# EAGLE design sound-detector (EAGLE 7.7.0)
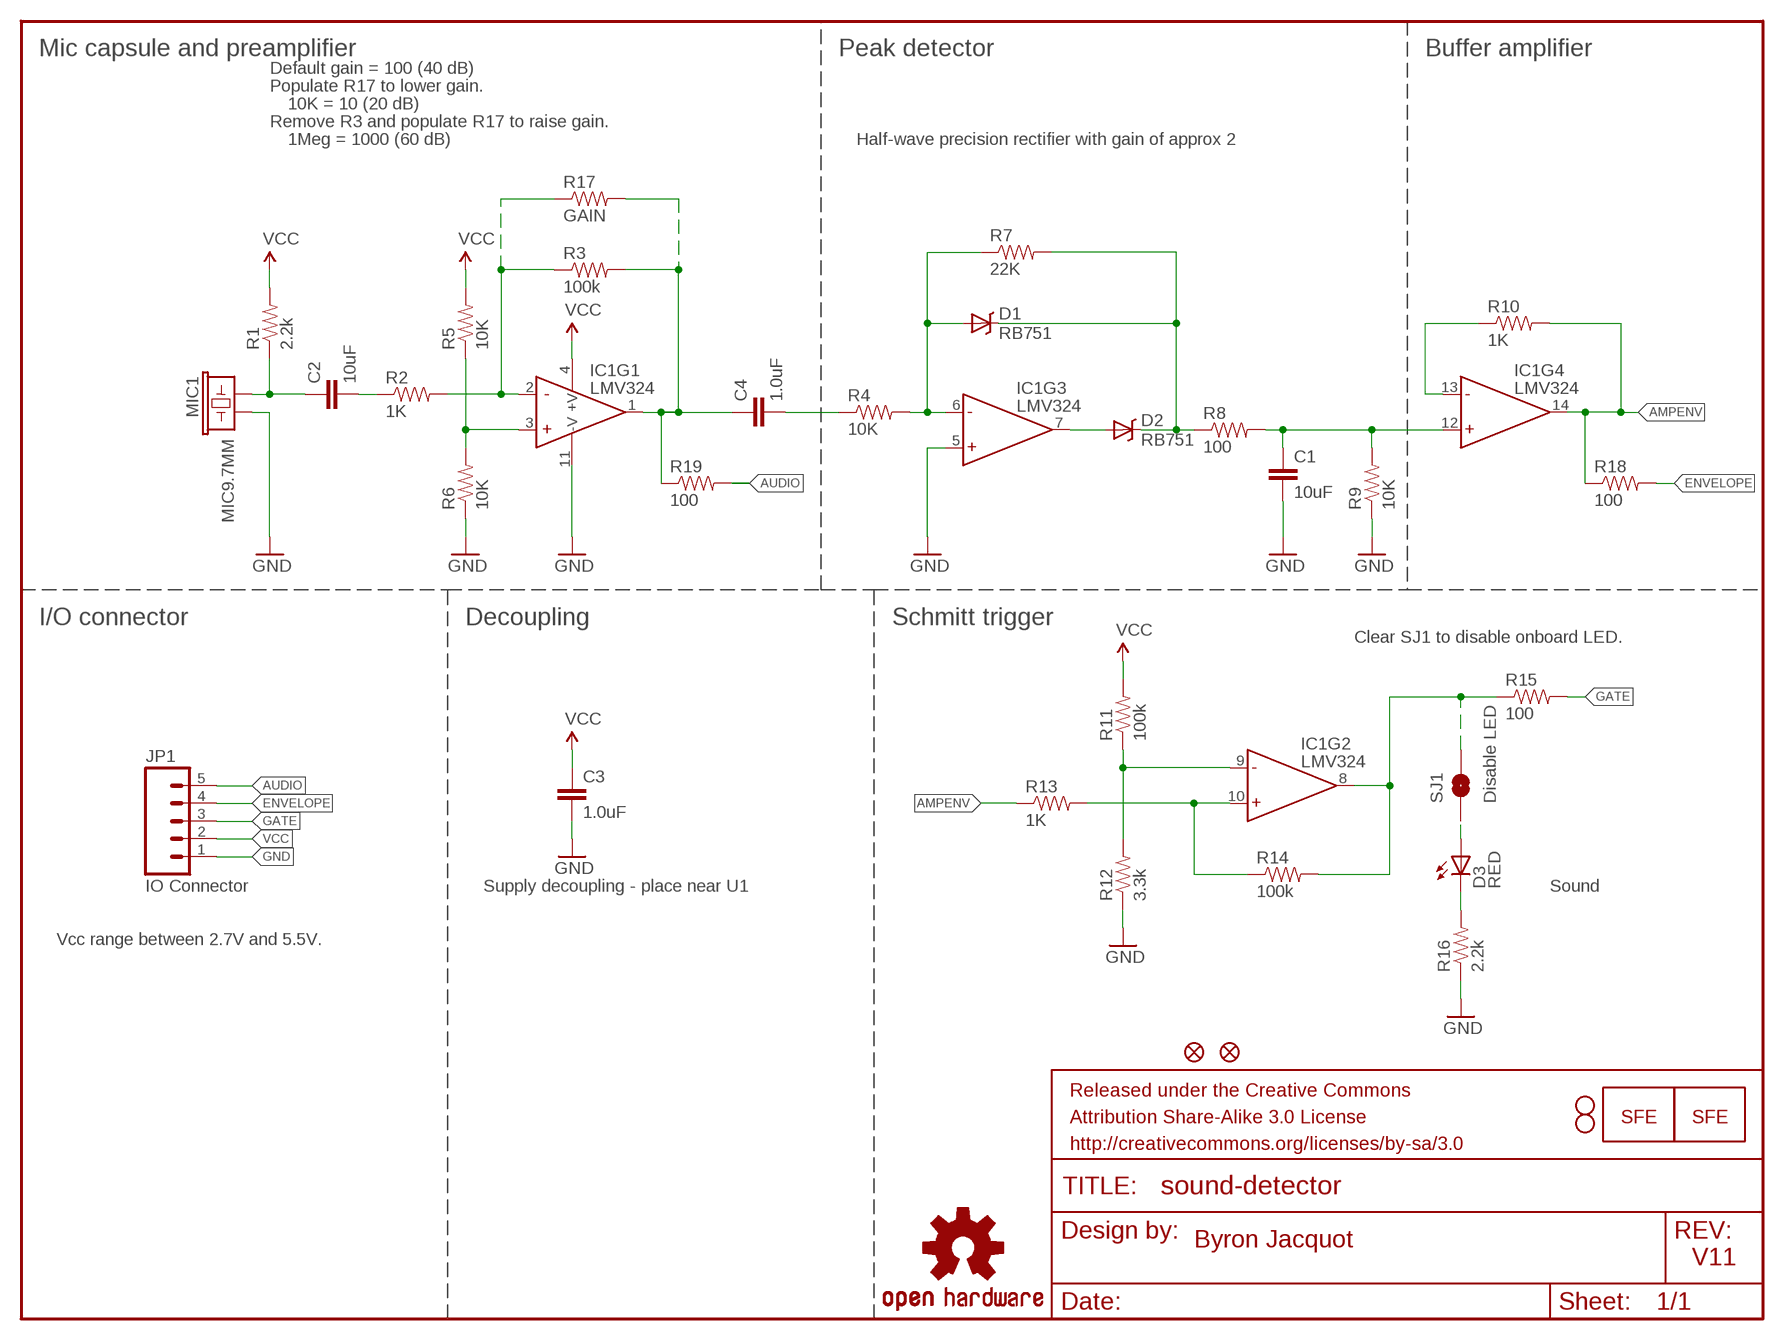
[diagram p0: schematic, sheet 1]

## Parts
C1  10uF  10UF-6.3V-20%(1206)  [1206]
C2  10uF  10UF-6.3V-20%(1206)  [1206]
C3  1.0uF  1.0UF-16V-10%(0603)  [0603-CAP]
C4  1.0uF  1.0UF-16V-10%(0603)  [0603-CAP]
D1  RB751  [SOD-523]
D2  RB751  [SOD-523]
D3  RED  LED-RED0603  [LED-0603]
FID3  FIDUCIAL1X2  [FIDUCIAL-1X2]
FID4  FIDUCIAL1X2  [FIDUCIAL-1X2]
FRAME1  FRAME-LETTER  [CREATIVE_COMMONS]
IC1  LMV324  [SO014]
JP1  IO Connector  M05PTH  [1X05]
LOGO1  OSHW-LOGOM  [OSHW-LOGO-M]
LOGO2  LOGO-SFENW2  [SFE-NEW-WEB]
LOGO3  LOGO-SFESK  [SFE-LOGO-FLAME]
MIC1  MIC9.7MM  [MIC-9.7MM]
R1  2.2k  2.2KOHM1/10W1%(0603)  [0603-RES]
R2  1K  1KOHM1/10W1%(0603)  [0603-RES]
R3  100k  100KOHM1/10W1%(0603)  [0603-RES]
R4  10K  10KOHM1/10W1%(0603)0603  [0603-RES]
R5  10K  10KOHM1/10W1%(0603)0603  [0603-RES]
R6  10K  10KOHM1/10W1%(0603)0603  [0603-RES]
R7  22K  22KOHM1/10W1%(0603)  [0603-RES]
R8  100  100OHM1/10W1%(0603)  [0603-RES]
R9  10K  10KOHM1/10W1%(0603)0603  [0603-RES]
R10  1K  1KOHM1/10W1%(0603)  [0603-RES]
R11  100k  100KOHM1/10W1%(0603)  [0603-RES]
R12  3.3k  3.3KOHM1/10W1%(0603)  [0603-RES]
R13  1K  1KOHM1/10W1%(0603)  [0603-RES]
R14  100k  100KOHM1/10W1%(0603)  [0603-RES]
R15  100  100OHM1/10W1%(0603)  [0603-RES]
R16  2.2k  2.2KOHM1/10W1%(0603)  [0603-RES]
R17  GAIN  RESISTORPTH-1/4W-VERT-KIT  [AXIAL-0.1EZ]
R18  100  100OHM1/10W1%(0603)  [0603-RES]
R19  100  100OHM1/10W1%(0603)  [0603-RES]
SJ1  Disable LED  SOLDERJUMPERNC  [SJ_2S]
STANDOFF1  STAND-OFF  [STAND-OFF]
STANDOFF2  STAND-OFF  [STAND-OFF]

## Nets
AMPENV: IC1.14(OUT) R10.2 R13.1 R18.1
AUDIO: JP1.5 R19.2
ENVELOPE: JP1.4 R18.2
GATE: JP1.3 R15.2
GND: C1.2 C3.2 IC1.5(+IN) IC1.11(-V) JP1.1 MIC1.2 R6.1 R9.1 R12.1 R16.1
N$: C4.1 IC1.1(OUT) R3.2 R17.P$2 R19.1
N$1: C2.1 MIC1.1 R1.1
N$2: IC1.3(+IN) R5.1 R6.2
N$3: D3.C R16.2
N$4: IC1.2(-IN) R2.2 R3.1 R17.P$1
N$5: C2.2 R2.1
N$6: C4.2 R4.1
N$7: D1.A IC1.6(-IN) R4.2 R7.1
N$8: D2.A IC1.7(OUT)
N$9: D1.C D2.C R7.2 R8.1
N$10: C1.1 IC1.12(+IN) R8.2 R9.2
N$11: IC1.13(-IN) R10.1
N$12: D3.A SJ1.1
N$15: IC1.9(-IN) R11.1 R12.2
N$16: IC1.10(+IN) R13.2 R14.1
N$17: IC1.8(OUT) R14.2 R15.1 SJ1.2
VCC: C3.1 IC1.4(+V) JP1.2 R1.2 R5.2 R11.2

## Notes on the sheet
- Mic capsule and preamplifier | Peak detector | Buffer amplifier
- Default gain = 100 (40 dB)
- Populate R17 to lower gain.
- 10K = 10 (20 dB)
- Remove R3 and populate R17 to raise gain.
- 1Meg = 1000 (60 dB) | Half-wave precision rectifier with gain of approx 2
- I/O connector | Decoupling | Schmitt trigger
- Clear SJ1 to disable onboard LED.
- Supply decoupling - place near U1 | Sound
- Vcc range between 2.7V and 5.5V.
- Byron Jacquot
- V11

## Library data of the parts
C1 C2 = SparkFun-Capacitors:10UF-6.3V-20%(1206): Ceramic CAP-10057; PROD_ID: CAP-10057
C3 C4 = SparkFun-Capacitors:1.0UF-16V-10%(0603): CAP-00868; PROD_ID: CAP-00868
D1 D2 = SparkFun-DiscreteSemi:RB751: 40V 120mA SOD-523 Schottky DIO-11018; PROD_ID: DIO-11018
D3 = SparkFun-LED:LED-RED: Assorted Red LEDs LilyPad 1206- DIO-09912 1206- DIO-00809 0603- DIO-00819; PROD_ID: DIO-00819
FID3 FID4 = SparkFun-Aesthetics:FIDUCIAL: Fiducial Alignment Points Various fiducial points for machine vision alignment.
FRAME1 = SparkFun-Aesthetics:FRAME-LETTER: Schematic Frame Standard 8.5x11 US Letter frame
IC1 = SparkFun-AnalogIC:LMV324: Jellybean quad op-amp; PROD_ID: IC-08227
JP1 = SparkFun-Connectors:M05: Header 5 Standard 5-pin 0.1" header. Use with straight break away headers (SKU : PRT-00116), right angle break away headers (PRT-00553), swiss pins (PRT-00743), machine pins (PRT-00117), and female headers (PRT-00115). Molex polarized connector foot print use with SKU : PRT-08230 with associated crimp pins and housings.
LOGO1 = SparkFun-Aesthetics:OSHW-LOGO: Open Source Hardware Logo This logo indicates the piece of hardware it is found on incorporates a OSHW license and/or adheres to the definition of open source hardware found here: http://freedomdefined.org/OSHW
LOGO2 LOGO3 = SparkFun-Aesthetics:LOGO-SFE: Spark Fun Electronics PCB Logo This is the standard Spark Fun Electronics PCB logo.
MIC1 = SparkFun-Sensors:MIC: Omni-directional electret microphone. 9.7mm standard diameter.; PROD_ID: COMP-08856
R1 R16 = SparkFun-Resistors:2.2KOHM1/10W1%(0603): RES-08272; PROD_ID: RES-08272
R2 R10 R13 = SparkFun-Resistors:1KOHM1/10W1%(0603): RES-07856; PROD_ID: RES-07856
R3 R11 R14 = SparkFun-Resistors:100KOHM1/10W1%(0603): RES-07828; PROD_ID: RES-07828
R4-R6 R9 = SparkFun-Resistors:10KOHM1/10W1%(0603): RES-00824; PROD_ID: RES-00824
R7 = SparkFun-Resistors:22KOHM1/10W1%(0603): RES-07853; PROD_ID: RES-07853
R8 R15 R18 R19 = SparkFun-Resistors:100OHM1/10W1%(0603): RES-07863; PROD_ID: RES-07863
R12 = SparkFun-Resistors:3.3KOHM1/10W1%(0603): RES-07851; PROD_ID: RES-07851
R17 = SparkFun-Resistors:RESISTOR: Resistor Basic schematic elements and footprints for 0603, 1206, and PTH resistors.
SJ1 = SparkFun-Passives:SOLDERJUMPER: Solder Jumper Standard SMD solder jumper. Used to automate production. Two varients : Normally Open and Normally Closed are the same, but have different paste layers. NC will have a large amount of paste and should jumper during reflow.
STANDOFF1 STANDOFF2 = SparkFun-Electromechanical:STAND-OFF: #4 Stand Off This is the mechanical footprint for a #4 phillips button head screw. Use the keepout ring to avoid running the screw head into surrounding components. SKU : PRT-00447

## Board
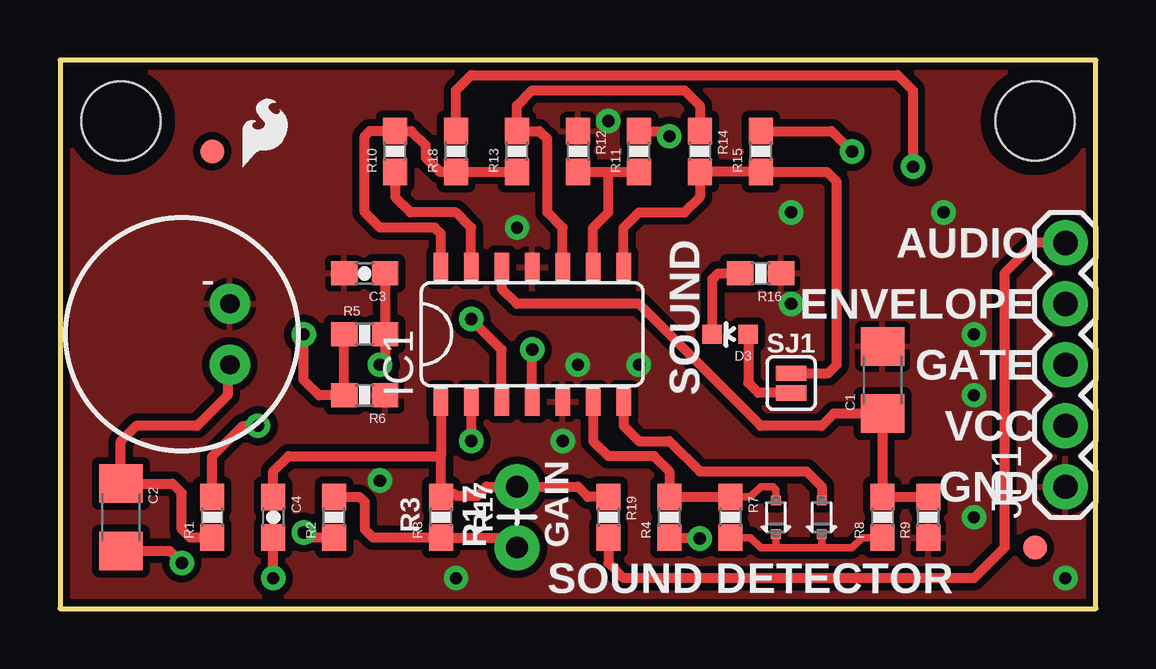
[diagram p1: board, top side]
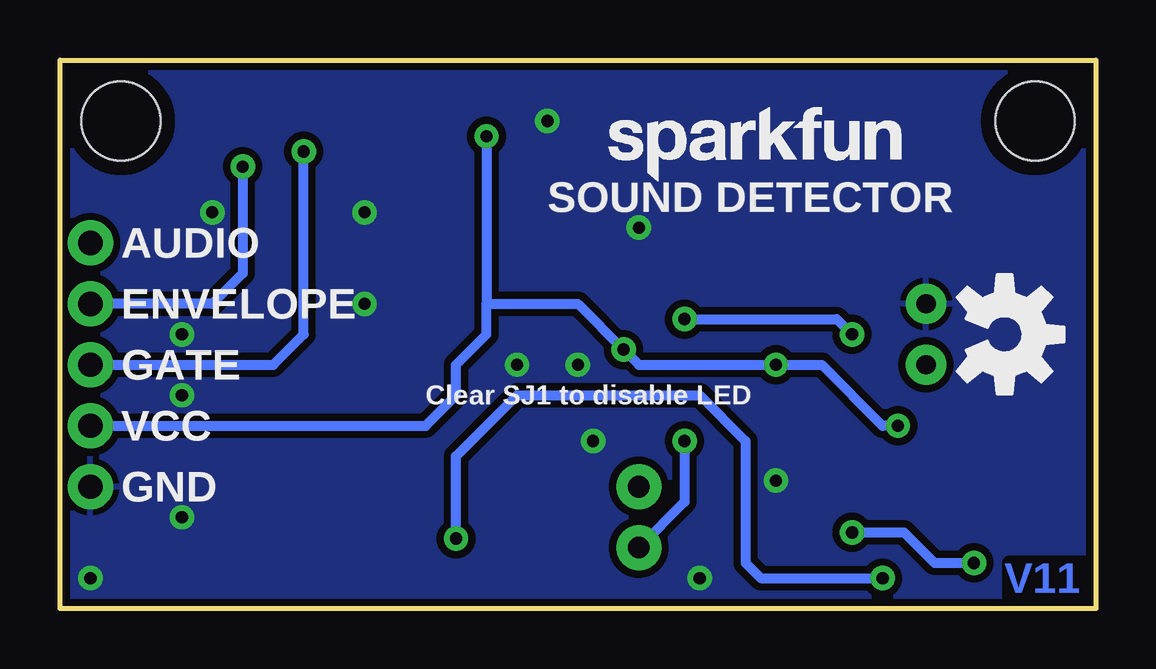
[diagram p2: board, bottom side, seen from below]

Size 43.18 x 22.86 mm. Coordinates in mm from the lower left corner, seen from the top.
Outline: 0,0 43.18,0 43.18,22.86 0,22.86 0,0
Copper layers (1*16): Top 0.035mm / dielectric 1.5mm / Bottom 0.035mm
Design rules "SparkFun-2-layer *": minimum track width 7mil, minimum drill 15mil, track to track 8mil, track to pad 8mil, pad to pad 8mil, via to via 8mil, smd to smd 8mil, copper to edge 8mil, drill to drill 8mil, minimum pad ring 12mil, minimum via ring 10mil, stop-mask expansion 4mil, vias tented up to drill 20mil, thermal gap 10mil

### Footprints (pad centres in the part's own frame; a part is rotated, then mirrored left to right if it is on the bottom)
1206 = smd 1.6 x 1.8: 1 -1.4,0; 2 1.4,0
0603-CAP = smd 1.1 x 1: 1 -0.85,0; 2 0.85,0
SOD-523 = smd 0.4 x 0.4: A -0.7,0; C 0.7,0
LED-0603 = smd 0.8 x 0.8: A 0,-0.75; C 0,0.75
FIDUCIAL-1X2 = smd 1 x 1: 1 0,0
SO014 = smd 0.6 x 1.2: 1 -3.175,-2.8; 2 -1.905,-2.8; 3 -0.635,-2.8; 4 0.635,-2.8; 5 1.905,-2.8; 6 3.175,-2.8; 7 4.445,-2.8; 8 4.445,2.8; 9 3.175,2.8; 10 1.905,2.8; 11 0.635,2.8; 12 -0.635,2.8; 13 -1.905,2.8; 14 -3.175,2.8
1X05 = drill 1.016 pad 1.88: 1 0,0; 2 2.54,0; 3 5.08,0; 4 7.62,0; 5 10.16,0
MIC-9.7MM = drill 0.8 pad 1.676: 1 -2,1.27; 2 -2,-1.27
0603-RES = smd 1.1 x 1: 1 -0.85,0; 2 0.85,0
AXIAL-0.1EZ = drill 0.9 pad 1.88: P$1 0,0; P$2 2.54,0
SJ_2S = smd 0.635 x 1.27: 1 -0.412,0; 2 0.412,0
STAND-OFF = hole 3.302: 0,0

### Placement (x,y rotation side)
C1  34.29,9.53 90 top
C2  2.54,3.81 270 top
C3  12.7,13.97 180 top
C4  8.89,3.81 270 top
D1  29.84,3.81 270 top
D2  31.75,3.81 270 top
D3  27.94,11.43 90 top
FID3  40.64,2.54 0 top
FID4  6.35,19.05 0 top
FRAME1  1.27,-10.16 0 top  (outside the outline)
IC1  19.05,11.43 0 top
JP1  41.91,5.08 90 top
LOGO1  3.81,11.43 270 bottom
LOGO2  20.32,17.78 0 bottom
LOGO3  7.62,18.41 0 top
MIC1  5.08,11.43 180 top
R1  6.35,3.81 90 top
R2  11.43,3.81 90 top
R3  15.88,3.81 90 top
R4  25.4,3.81 90 top
R5  12.7,11.43 0 top
R6  12.7,8.89 180 top
R7  27.94,3.81 270 top
R8  34.29,3.81 90 top
R9  36.2,3.81 90 top
R10  13.97,19.05 90 top
R11  24.13,19.05 90 top
R12  21.59,19.05 270 top
R13  19.05,19.05 90 top
R14  26.67,19.05 270 top
R15  29.21,19.05 90 top
R16  29.21,13.97 180 top
R17  19.05,2.54 90 top
R18  16.51,19.05 90 top
R19  22.86,3.81 270 top
SJ1  30.48,9.4 90 top
STANDOFF1  2.54,20.32 0 top
STANDOFF2  40.64,20.32 0 top

### Tracks (layer width: path | path; a pad name or v marks a point on that pad's centre or on a via)
AMPENV
  Top 0.406: R13.1 R18.1 15.84,18.2 15.24,18.8 15.24,19.3 14.64,19.9 R10.2 12.91,19.9 12.7,19.68 12.7,16.51 13.34,15.88 15.62,15.88 15.88,15.62 IC1.14
AUDIO
  Top 0.406: JP1.5 40.64,15.24 39.37,13.97 39.37,2.54 38.1,1.27 23.5,1.27 22.86,1.91 R19.2
ENVELOPE  (via drill 0.51)
  Top 0.406: R18.2 16.51,21.59 17.14,22.23 34.92,22.23 35.56,21.59 v35.56,18.41
  Bottom 0.406: v35.56,18.41 35.56,13.97 36.83,12.7 JP1.4
GATE  (via drill 0.51)
  Top 0.406: R15.2 32.17,19.9 v33.02,19.05
  Bottom 0.406: JP1.3 34.29,10.16 33.02,11.43 v33.02,19.05
GND  (via drill 0.51)
  other vias: 22.86,20.32 19.05,15.88 38.1,3.81 38.1,8.89 36.83,16.51 38.1,11.43 24.13,10.16 21.59,10.16 41.91,1.27 16.51,1.27 30.48,16.51 30.48,12.7 13.34,5.33 20.95,6.99
  pour Bottom (isolate 0.305): 0,0 0,22.86 43.18,22.86 43.18,0
  pour Top (isolate 0.305): 0,0 0,22.86 43.18,22.86 43.18,0
N$
  Top 0.406: IC1.1 15.88,6.35 | 15.88,6.35 R3.2 arc-90 16.55,4.7 17.4,4.7 17.78,5.08 R17.P$2 21.59,5.08 22.01,4.66 R19.1 | C4.1 8.89,5.71 9.53,6.35 15.88,6.35
N$1
  Top 0.406: MIC1.1 6.99,10.06 6.99,8.89 5.71,7.62 3.17,7.62 2.54,6.99 C2.1 4.7,5.21 5.08,4.83 5.08,3.3 5.42,2.96 R1.1
N$2  (via drill 0.51)
  Top 0.406: R5.1 R6.2 10.79,8.89 10.16,9.53 v10.16,11.43 | IC1.3 18.41,10.79 v17.14,12.06
  Bottom 0.406: v17.14,12.06 10.79,12.06 v10.16,11.43
N$3
  Top 0.406: D3.C 27.19,13.73 27.43,13.97 R16.2
N$4  (via drill 0.51)
  Top 0.406: R17.P$1 18.63,2.96 R3.1 13.04,2.96 12.7,3.3 12.7,4.45 12.48,4.66 R2.2 | IC1.2 v17.14,6.99
  Bottom 0.406: v17.14,6.99 17.14,4.45 R17.P$1
N$5  (via drill 0.51)
  Top 0.406: R2.1 10.38,2.96 v10.16,3.17 | C2.2 4.58,2.41 v5.08,1.91
  Bottom 0.406: v10.16,3.17 8,3.17 6.73,1.91 v5.08,1.91
N$6  (via drill 0.51)
  Top 0.406: v8.89,1.27 C4.2 | 25.36,2.96 R4.1 26.63,2.96 v26.67,2.92
  Bottom 0.406: v26.67,2.92 26.67,6.35 24.13,8.89 16.51,8.89 14.61,6.99 14.61,1.91 13.97,1.27 v8.89,1.27
N$7
  Top 0.305: D1.A 29.84,4.95 29.72,5.08 29.21,5.08 28.79,4.66 R7.1
  Top 0.406: IC1.6 22.23,6.99 22.86,6.35 24.77,6.35 25.4,5.71 R4.2 R7.1 | 28.24,4.36 R7.1 | 27.94,4.51 R7.1
N$8
  Top 0.406: IC1.7 23.5,7.62 24.13,6.99 25.4,6.99 26.67,5.71 31.11,5.71 31.75,5.08 D2.A
N$9
  Top 0.305: 29.84,2.54 29.21,2.54 28.79,2.96 R7.2 | 29.84,2.54 31.75,2.54 | 31.75,2.54 33.02,2.54 33.44,2.96 R8.1 | D1.C 29.84,2.54 | D2.C 31.75,2.54
  Top 0.406: 27.94,3.11 R7.2 | 34.29,3.11 R8.1
N$10
  Top 0.406: R9.2 R8.2 C1.1 32.26,8.12 31.75,7.62 29.21,7.62 24.13,12.7 19.05,12.7 18.41,13.34 IC1.12
N$11
  Top 0.406: R10.1 13.97,17.14 14.61,16.51 16.51,16.51 17.14,15.88 IC1.13
N$12
  Top 0.406: SJ1.1 29.11,8.99 28.69,9.41 D3.A
N$15
  Top 0.406: R12.2 22.86,18.2 | 22.86,18.2 R11.1 | IC1.9 22.23,15.88 22.86,16.51 22.86,18.2
N$16
  Top 0.406: R14.1 26.67,20.95 26.04,21.59 19.68,21.59 19.05,20.95 R13.2 19.98,19.9 20.32,19.56 20.32,16.51 20.95,15.88 IC1.10
N$17
  Top 0.406: SJ1.2 32.03,9.81 32.38,10.16 32.38,17.78 31.96,18.2 R15.1 R14.2 26.67,17.14 26.04,16.51 24.13,16.51 23.5,15.88 IC1.8
VCC  (via drill 0.51)
  Top 0.406: C3.1 R5.2 13.55,10.38 v13.34,10.16 | R1.2 6.35,6.35 7.62,7.62 v8.26,7.62 | IC1.4 v19.68,10.79 | R11.2 25.18,19.9 v25.4,19.68
  Bottom 0.406: JP1.2 27.94,7.62 26.67,8.89 26.67,10.16 25.4,11.43 25.4,12.7 | 25.4,12.7 21.59,12.7 v19.68,10.79 19.05,10.16 v13.34,10.16 11.43,10.16 8.89,7.62 v8.26,7.62 | v25.4,19.68 25.4,12.7

### Text on the board
Bottom: V11
tPlace: AUDIO | ENVELOPE | SJ1 | GATE | SOUND | VCC | GND | R3 | R17 | SOUND DETECTOR
bPlace: SOUND DETECTOR | AUDIO | ENVELOPE | GATE | Clear SJ1 to disable LED | VCC | GND
tDocu: Byron Jacquot